# EAGLE design battery_pack (EAGLE 8.3.2)
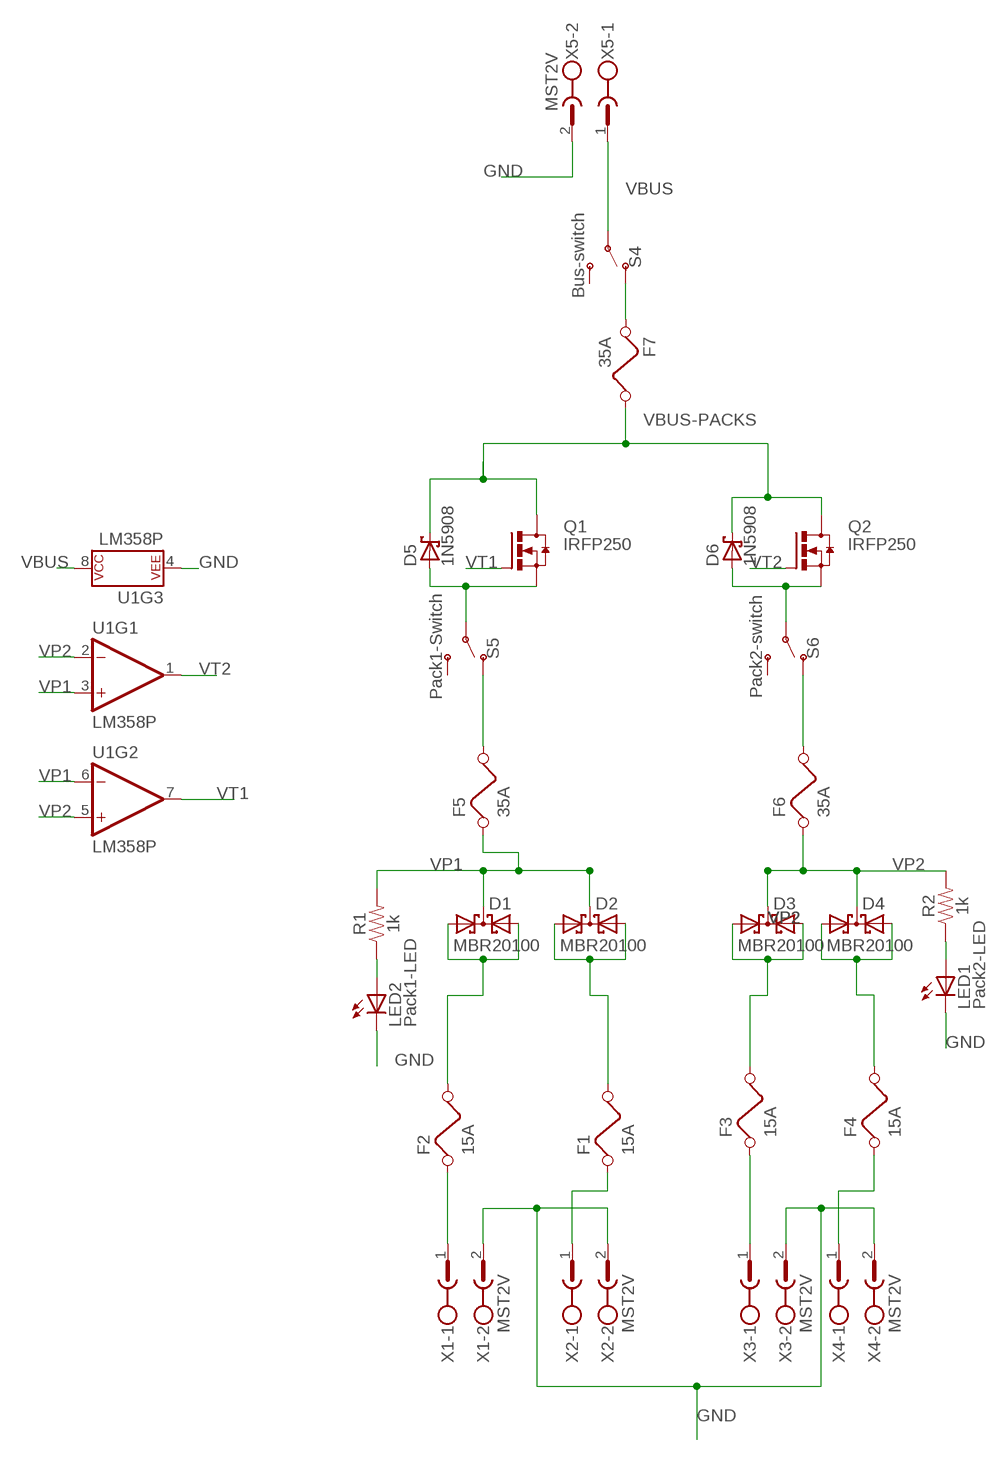
[diagram p0: schematic, sheet 1]

## Parts
D1  MBR20100  DIODE_2SCHOTTKY-SOT82H  [SOT82L]
D2  MBR20100  DIODE_2SCHOTTKY-SOT82H  [SOT82L]
D3  MBR20100  DIODE_2SCHOTTKY-SOT82H  [SOT82L]
D4  MBR20100  DIODE_2SCHOTTKY-SOT82H  [SOT82L]
D5  1N5908  [C4111-15]
D6  1N5908  [C4111-15]
F1  15A  FUSE  [FUSE]
F2  15A  FUSE  [FUSE]
F3  15A  FUSE  [FUSE]
F4  15A  FUSE  [FUSE]
F5  35A  FUSE  [FUSE]
F6  35A  FUSE  [FUSE]
F7  35A  FUSE  [FUSE]
LED1  Pack2-LED  LEDB156  [Q62902-B156]
LED2  Pack1-LED  LEDB156  [Q62902-B156]
Q1  IRFP250  [TO-247AD-V]
Q2  IRFP250  [TO-247AD-V]
R1  1k  1KOHM  [AXIAL-0.4]
R2  1k  1KOHM  [AXIAL-0.4]
S4  Bus-switch  SWITCH-SPDT-PTH-11.6X4.0MM-LOCK  [SWITCH_SPDT_PTH_11.6X4.0MM_LOCK]
S5  Pack1-Switch  SWITCH-SPDT-PTH-11.6X4.0MM-LOCK  [SWITCH_SPDT_PTH_11.6X4.0MM_LOCK]
S6  Pack2-switch  SWITCH-SPDT-PTH-11.6X4.0MM-LOCK  [SWITCH_SPDT_PTH_11.6X4.0MM_LOCK]
U1  LM358P  LM358DIP08_LONGPAD  [DIP08_LONGPAD]
X1  MST2V  [MSTBV2]
X2  MST2V  [MSTBV2]
X3  MST2V  [MSTBV2]
X4  MST2V  [MSTBV2]
X5  MST2V  [MSTBV2]

## Nets
GND: LED1.K(C) LED2.K(C) U1.4(P$V-) X1.2 X2.2 X3.2 X4.2 X5.2
N$2: F2.1 X1.1
N$3: F3.1 X3.1
N$4: F1.1 X2.1
N$5: D1.A1 D1.A2 F2.2
N$6: D2.A1 D2.A2 F1.2
N$7: D3.A1 D3.A2 F3.2
N$8: D4.A1 D4.A2 F4.2
N$9: D5.A Q1.S S5.2(P)
N$10: D6.A Q2.S S6.2(P)
N$11: LED2.A R1.P$1
N$12: LED1.A R2.P$1
N$13: F6.2 S6.1(O)
N$14: F7.1 S4.1(O)
N$15: F5.2 S5.1(O)
N$16: F4.1 X4.1
VBUS: S4.2(P) U1.8(P$V+) X5.1
VBUS-PACKS: D5.C D6.C F7.2 Q1.D Q2.D
VP1: D1.C D2.C F5.1 R1.P$2 U1.3(+IN) U1.6(-IN)
VP2: D3.C D4.C F6.1 R2.P$2 U1.2(-IN) U1.5(+IN)
VT1: Q1.G U1.7(OUT)
VT2: Q2.G U1.1(OUT)
Unconnected: S4.3(S) S5.3(S) S6.3(S)

## Library data of the parts
D1-D4 = diode:DIODE_2SCHOTTKY-: Dual SCHOTTKY DIODE common cathode
D5 D6 = diode:1N5908: DIODE schottky
F1-F7 = special:FUSE: FUSE 5 x 20 mm
LED1 LED2 = led:LED: LED OSRAM: - CHIPLED LG R971, LG N971, LY N971, LG Q971, LY Q971, LO R971, LY R971 LH N974, LH R974 LS Q976, LO Q976, LY Q976 LO Q996 - Hyper CHIPLED LW Q18S LB Q993, LB Q99A, LB R99A - SideLED LS A670, LO A670, LY A670, LG A670, LP A670 LB A673, LV A673, LT A673, LW A673 LH A674 LY A675 LS A676, LA A676, LO A676, LY A676, LW A676 LS A679, LY A679, LG A679 - Hyper Micro SIDELED® LS Y876, LA Y876, LO Y876, LY Y876 LT Y87S - SmartLED LW L88C, LW L88S LB L89C, LB L89S, LG L890 LS L89K, LO L89K, LY L89K LS L896, LA L896, LO L896, LY L896 - TOPLED LS T670, LO T670, LY T670, LG T670, LP T670 LSG T670, LSP T670, LSY T670, LOP T670, LYG T670 LG T671, LOG T671, LSG T671 LB T673, LV T673, LT T673, LW T673 LH T674 LS T676, LA T676, LO T676, LY T676, LB T676, LH T676, LSB T676, LW T676 LB T67C, LV T67C, LT T67C, LS T67K, LO T67K, LY T67K, LW E67C LS E67B, LA E67B, LO E67B, LY E67B, LB E67C, LV E67C, LT E67C LW T67C LS T679, LY T679, LG T679 LS T770, LO T770, LY T770, LG T770, LP T770 LB T773, LV T773, LT T773, LW T773 LH T774 LS E675, LA E675, LY E675, LS T675 LS T776, LA T776, LO T776, LY T776, LB T776 LHGB T686 LT T68C, LB T68C - Hyper Mini TOPLED® LB M676 - Mini TOPLED Santana® LG M470 LS M47K, LO M47K, LY M47K Source: http://www.osram.convergy.de LUXEON: - LUMILED® LXK2-PW12-R00, LXK2-PW12-S00, LXK2-PW14-U00, LXK2-PW14-V00 LXK2-PM12-R00, LXK2-PM12-S00, LXK2-PM14-U00 LXK2-PE12-Q00, LXK2-PE12-R00, LXK2-PE12-S00, LXK2-PE14-T00, LXK2-PE14-U00 LXK2-PB12-K00, LXK2-PB12-L00, LXK2-PB12-M00, LXK2-PB14-N00, LXK2-PB14-P00, LXK2-PB14-Q00 LXK2-PR12-L00, LXK2-PR12-M00, LXK2-PR14-Q00, LXK2-PR14-R00 LXK2-PD12-Q00, LXK2-PD12-R00, LXK2-PD12-S00 LXK2-PH12-R00, LXK2-PH12-S00 LXK2-PL12-P00, LXK2-PL12-Q00, LXK2-PL12-R00 Source: www.luxeon.com KINGBRIGHT: KA-3528ASYC Source: www.kingbright.com
Q1 Q2 = transistor-power:IRFP25*: 33A/27A, 200V/150V, 0.085/0.012 Ohm, N-Channel Power MOSFET Source: Fairchild Semiconductor Corporation
R1 R2 = resistors-longpads:1KOHM: 1kΩ resistor A resistor is a passive two-terminal electrical component that implements electrical resistance as a circuit element. Resistors act to reduce current flow, and, at the same time, act to lower voltage levels within circuits. - Wikipedia
S4-S6 = switch-longpads:SWITCH-SPDT: Single Pole, Double Throw (SPDT) Switch Single-pole, double-throw (SPDT) switch. Variant Overview SMD-AYZ0202 Surface Mount DPDT Switch <https://www.sparkfun.com/products/597> (COM-00597) Used on e.g. LilyPad Arduino USB - ATmega32U4 Board <https://www.sparkfun.com/products/12049> PTH-11.6X4.0MM SPDT Mini Power Switch <https://www.sparkfun.com/products/102> (COM-00102) Used on e.g. SparkFun Simon Says - Through-Hole Soldering Kit <https://www.sparkfun.com/products/10547> (KIT-10547) PTH-11.6X4.0MM-KIT KIT version of SPDT Mini Power Switch - Simplifies soldering by removing tStop of switch pins - only one side can be soldered. PTH-11.6X4.0MM-LOCK LOCK version of SPDT Mini Power Switch - Offset pins hold switch in place for easier soldering. SMD-RIGHT-ANGLE Surface Mount Right Angle Switch <https://www.sparkfun.com/products/10860> (COM-10860) Used on e.g. SparkFun ESP8266 Thing <https://www.sparkfun.com/products/13231>; PROD_ID: SWCH-08261; SF_SKU: COM-00102
U1 = SparkFun-IC-Amplifiers:LM358: LM358 Jellybean op-amp Datasheet <http://www.sparkfun.com/datasheets/Components/General/LM358.pdf> SparkFun Products Op-Amp (Thru-Hole) - LM358 <https://www.sparkfun.com/products/9456> (COM-09456)
X1-X5 = con-phoenix-508:MST2V: PHOENIX; OC_FARNELL: unknown; OC_NEWARK: unknown

## Board
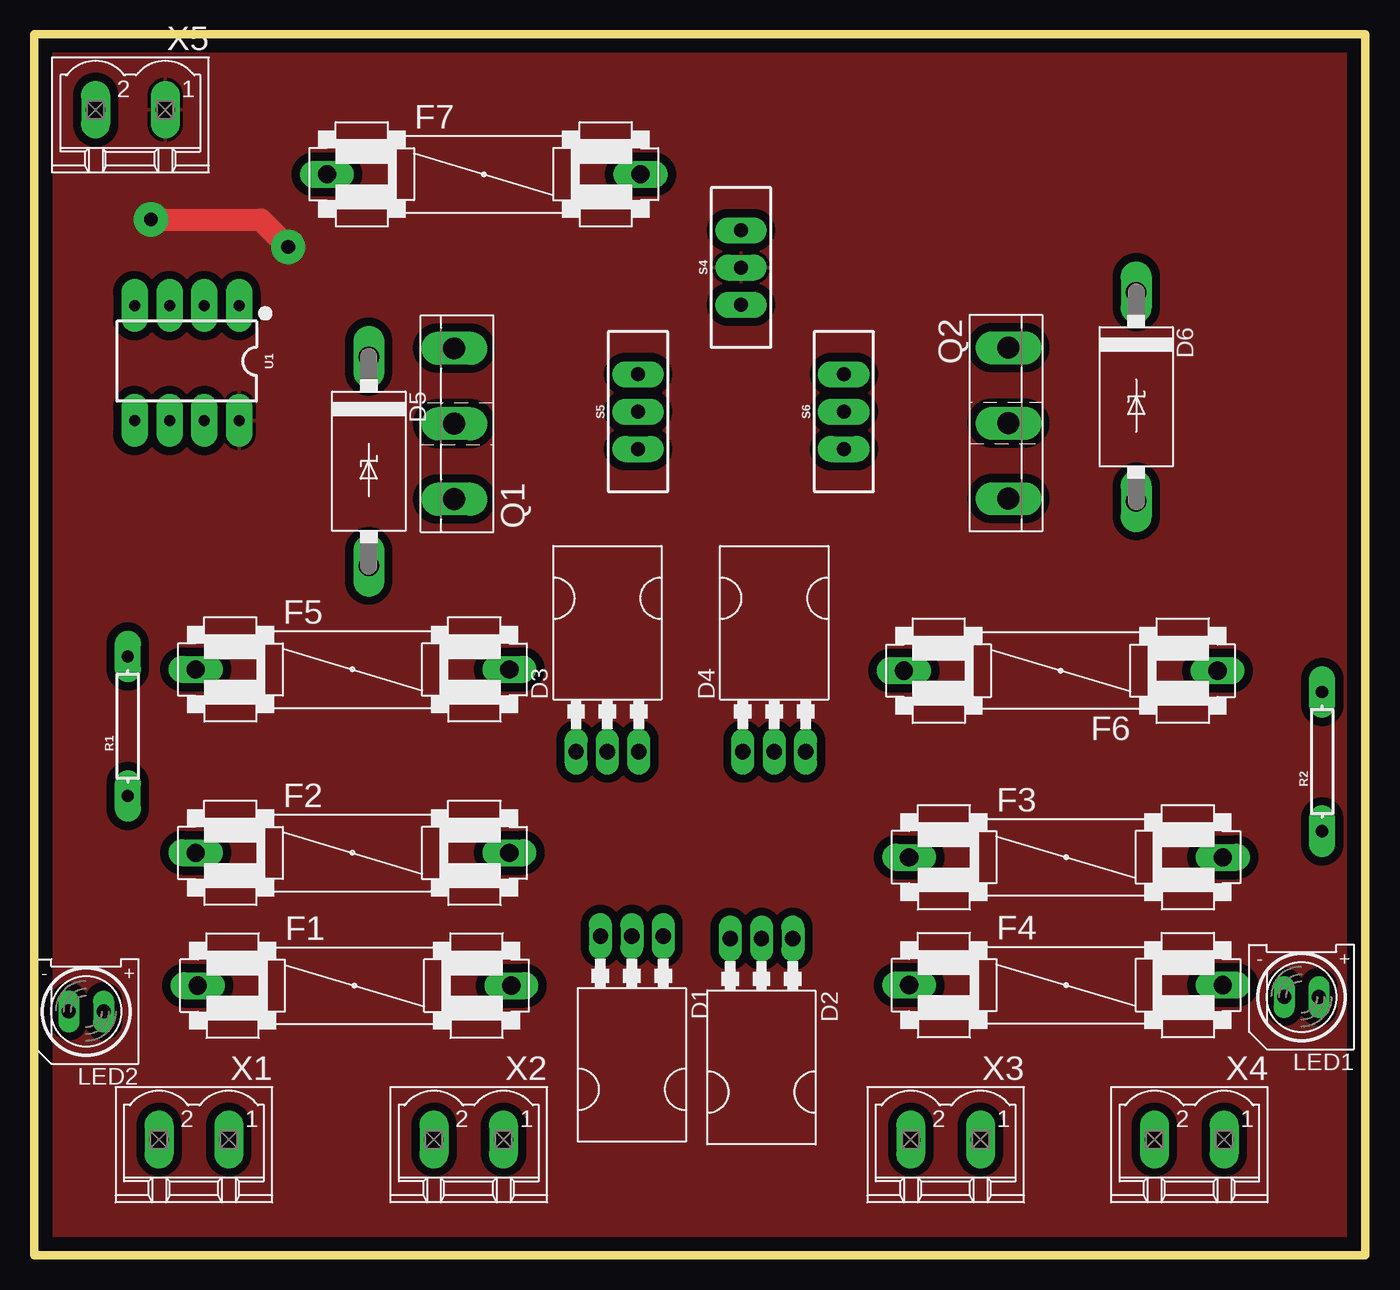
[diagram p1: board, top side]
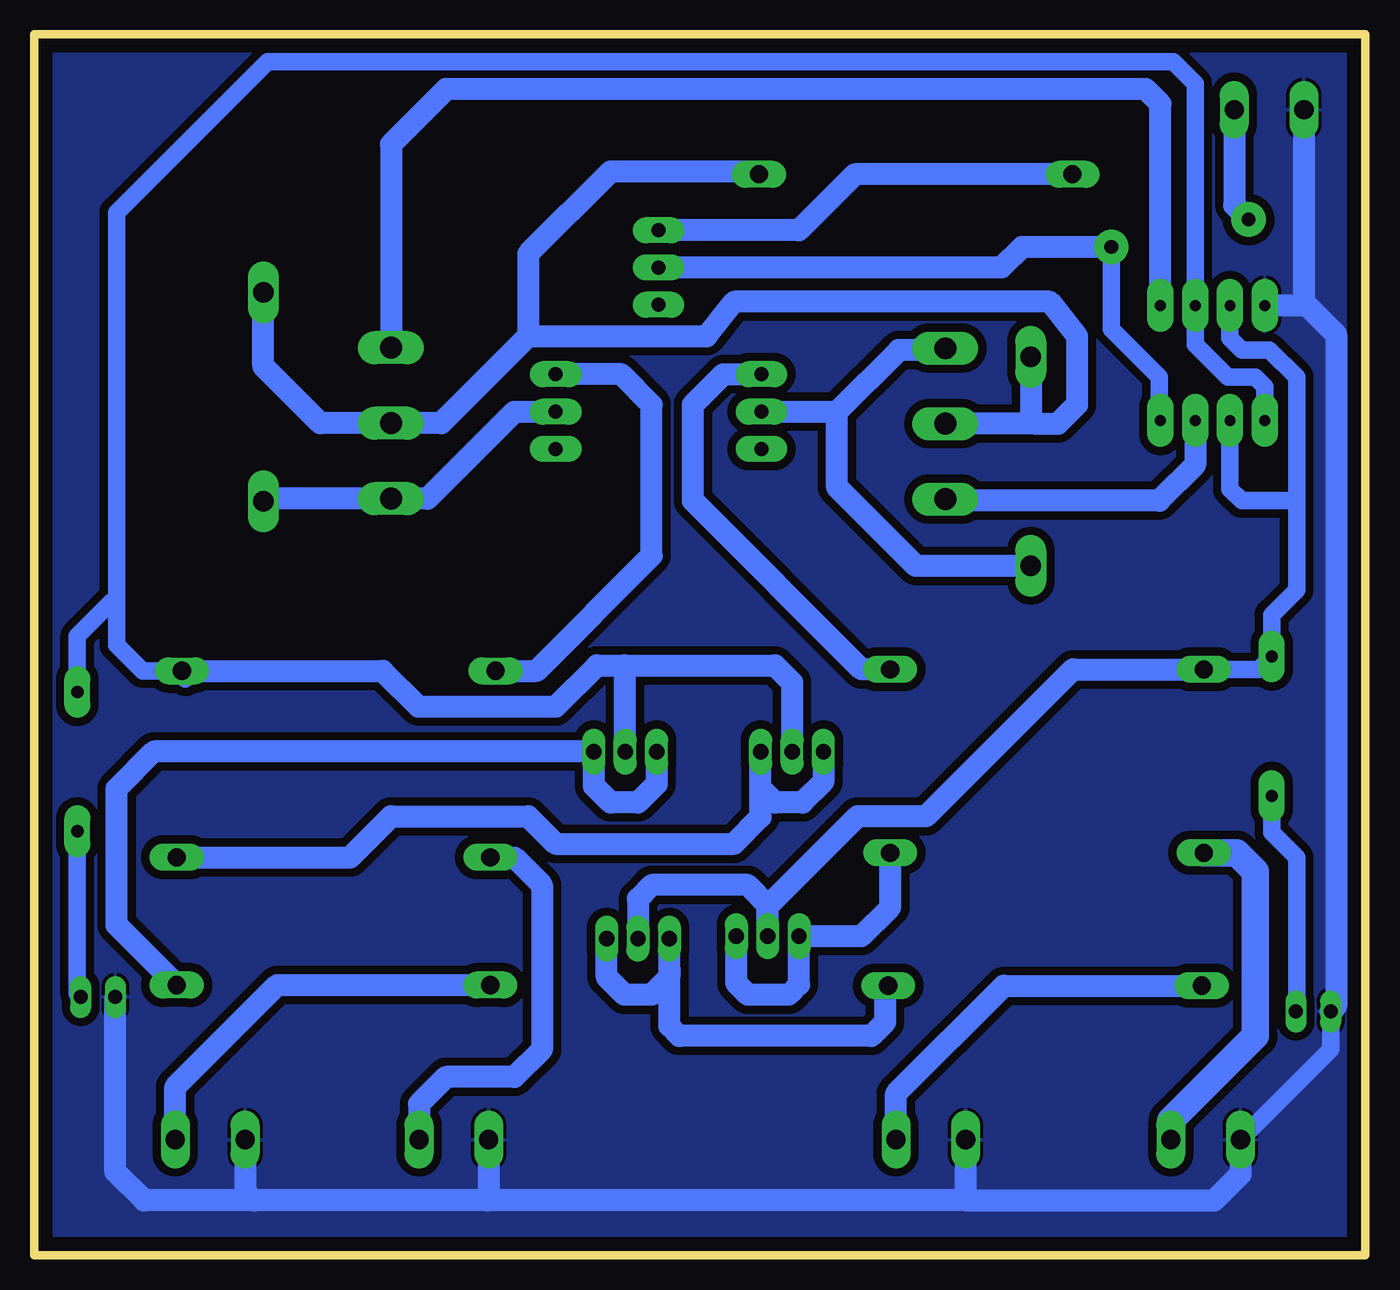
[diagram p2: board, bottom side, seen from below]

Size 97 x 89 mm. Coordinates in mm from the lower left corner, seen from the top.
Outline: 0,0 97,0 97,89 0,89 0,0
Copper layers (1*16): Top 0.035mm / dielectric 1.5mm / Bottom 0.035mm
Design rules "default *": minimum track width 6mil, minimum drill 0.7mm, track to track 6mil, track to pad 6mil, pad to pad 6mil, via to via 6mil, smd to smd 6mil, copper to edge 40mil, drill to drill 6mil, minimum pad ring 10mil, minimum via ring 8mil, stop-mask expansion 4mil, vias tented up to drill 0mil, thermal gap 10mil

### Footprints (pad centres in the part's own frame; a part is rotated, then mirrored left to right if it is on the bottom)
SOT82L = drill 1.118 long: A1 -2.286,-5.08; A2 2.286,-5.08; C 0,-5.08
C4111-15 = drill 1.499 long: A 7.62,0; C -7.62,0
FUSE = drill 1.321 long: 1 -11.43,0; 2 11.43,0
Q62902-B156 = drill 1.016 long: A -1.27,0; K 1.27,0
TO-247AD-V = drill 1.6 long: D 0,-2.54; G -5.5,-2.54; S 5.5,-2.54
AXIAL-0.4 = drill 0.9 pad 1.88 long: P$1 -3.81,0; P$2 6.35,0
SWITCH_SPDT_PTH_11.6X4.0MM_LOCK = drill 1.016 pad 1.88 long: 1 0,2.718; 2 0,0; 3 0,-2.718
DIP08_LONGPAD = drill 0.8 pad 1.93 long: 1 -3.81,-4.064; 2 -1.27,-4.064; 3 1.27,-4.064; 4 3.81,-4.064; 5 3.81,4.318; 6 1.27,4.318; 7 -1.27,4.318; 8 -3.81,4.318
MSTBV2 = drill 1.397 long: 1 -2.54,0; 2 2.54,0

### Placement (x,y rotation side)
D1  43.55,18.2 180 top
D2  53,18 180 top
D3  41.77,41.8 0 top
D4  53.93,41.8 0 top
D5  24.38,57.88 270 top
D6  80.31,62.58 270 top
F1  23.34,19.66 0 top
F2  23.19,29.34 0 top
F3  75.19,29.02 0 top
F4  75.19,19.7 0 top
F5  23.19,42.71 0 top
F6  74.81,42.61 180 top
F7  32.76,78.8 0 top
LED1  92.36,18.83 180 top
LED2  3.78,17.78 180 top
Q1  28.07,60.61 90 top
Q2  73.55,60.66 270 top
R1  6.81,37.3 90 top
R2  93.86,34.72 90 top
S4  51.5,72 0 top
S5  44,61.5 0 top
S6  59,61.5 0 top
U1  11.12,65.17 180 top
X1  11.63,8.44 180 top
X2  31.66,8.44 180 top
X3  66.42,8.44 180 top
X4  84.18,8.44 180 top
X5  7,83.5 180 top

### Tracks (layer width: path | path; a pad name or v marks a point on that pad's centre or on a via)
GND
  Bottom 1.27: X1.2 2.51,15.02 LED2.K
  Bottom 1.6: 4.23,69.23 U1.4 | 4.23,69.23 2.12,67.12 2.12,18.17 LED2.K | X1.2 9.09,5.91 11,4 29,4 | 81,4 89,4 91.09,6.09 LED1.K | 29,4 64,4 | 64,4 81,4 | X4.2 81.64,4.64 81,4 | X3.2 63.88,4.12 64,4 | X2.2 29.12,4.12 29,4 | X5.2 4.46,69.46 4.23,69.23
  pour Bottom (isolate 0.61): 0,0.5 0,89.5 96.5,89.5 97,0 0.5,0
N$2
  Bottom 2: X1.1 14.17,9.83 8,16 8,28 9.34,29.34 F2.1
N$3
  Bottom 1.6: F3.1 63.74,29 62,29 60,27 60,15 62,13 67,13 68.96,11.04 X3.1
N$4
  Bottom 1.6: X2.1 34.2,11.8 26.34,19.66 F1.1
N$5
  Bottom 1.6: D1.A1 45.84,19.84 45,19 42,19 41.26,19.74 D1.A2 36.72,23.28 34.62,25.38 F2.2
N$6
  Bottom 1.6: 50.71,21 D2.A2 | 50.71,21 50.71,20.29 52,19 54,19 55.29,20.29 D2.A1 | F1.2 35,19.43 35,17 36,16 50,16 50.71,16.71 50.71,21
N$7
  Bottom 1.6: F3.2 86.6,29 74,29 71,32 61,32 59,30 46,30 44.06,31.94 44.06,34.06 | D3.A1 39.48,34.52 41,33 43,33 44.06,34.06 | 44.06,34.06 D3.A2
N$8
  Bottom 1.6: F4.2 91,24.08 91,34 88.28,36.72 D4.A2 56.22,34.22 55,33 53,33 51.64,34.36 D4.A1
N$9
  Bottom 1.6: 30.43,65.93 Q1.S 30.72,66 34,66 38.5,61.5 | S5.2 38.5,61.5 | D5.A 32.76,50.26 38.5,56 38.5,61.5
N$10
  Bottom 1.6: S6.2 62,61.5 68.34,55.16 Q2.S 80.11,55.16 D6.A
N$11
  Bottom 1.27: LED2.A 5,17.83 5,29 6.81,30.81 R1.P$1
N$12
  Bottom 1.27: LED1.A 93.86,19.06 R2.P$1
N$13
  Bottom 1.6: F6.2 60.39,42.61 52,51 52,62 54.22,64.22 S6.1
N$14
  Bottom 1.6: F7.1 37.2,78.8 41.28,74.72 S4.1
N$15
  Bottom 1.6: F5.2 36.71,42.71 49,55 49,62 46.78,64.22 S5.1
N$16
  Bottom 1.6: X4.1 86.72,12.28 79.3,19.7 F4.1
VBUS  (via drill 1 pad 2.5)
  Top 1.6: v8.5,75.5 16.5,75.5 v18.5,73.5
  Bottom 1.27: U1.8 15,60.92 15,64 18.5,67.5 v18.5,73.5
  Bottom 1.6: X5.1 9.54,76.54 v8.5,75.5 | v18.5,73.5 25,73.5 26.5,72 S4.2
  pour Top (isolate 0.61): 0,89 97,89 97,-1 0.5,-1 0,-0.5
VBUS-PACKS
  Bottom 1.6: 24,60.61 22.39,60.61 21,62 21,67 23,69.5 46,69.5 48,67 61,67 | 24,60.61 Q1.D | F7.2 44.39,79 55,79 61,73 61,67 | 61,67 67.34,60.66 Q2.D 76.16,60.66 80.31,64.81 D6.C | D5.C 24.38,60.99 24,60.61
VP1
  Bottom 1.27: F5.1 7.75,42.71 R1.P$2 6.81,46.69 5,48.5 5,55 | 5,55 5,64 7,66 9,66 9.85,66.85 U1.3 | U1.6 9.85,55.85 9,55 5,55
  Bottom 1.6: D2.C 53,26 52,27 45,27 43.55,25.55 D1.C 43.55,25.45 37,32 32,32 21.29,42.71 F5.1
VP2
  Bottom 1.27: 7,60 U1.5 7.31,63.31 8,64 10,64 12.39,66.39 U1.2 12.39,85.39 14,87 80,87 91,76 91,48.5 | 86,42 F6.1 89.11,42.61 91,44.5 91,48.5 | R2.P$2 93.86,45.14 91.39,47.61 91,47.61 91,48.5
  Bottom 1.6: 54,43 56,43 59,40 69,40 71.61,42.61 F6.1 | D4.C 53.93,42.93 54,43 | 54,43 43,43 41.77,41.77 D3.C
VT1
  Bottom 1.6: U1.7 12.39,57.61 15,55 30.5,55 Q1.G
VT2
  Bottom 1.6: U1.1 14.93,83.93 16,85 67,85 71.01,80.99 Q2.G